# EAGLE schematic Main_backup (EAGLE 7.2.0)
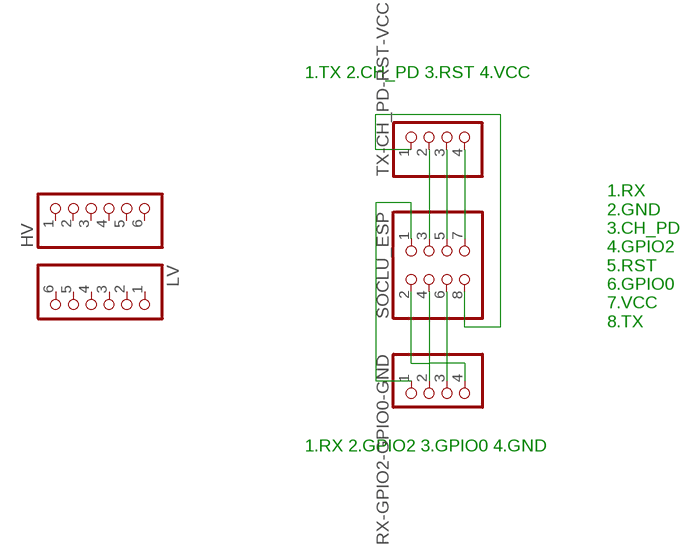
[diagram p0: schematic, sheet 1]

## Parts
HV  PINHD-1X6  [1X06]
LV  PINHD-1X6  [1X06]
RX-GPIO2-GPIO0-GND  PINHD-1X4  [1X04]
SOCLU_ESP  PINHD-2X4  [2X04]
TX-CH_PD-RST-VCC  PINHD-1X4  [1X04]

## Nets
N$1: SOCLU_ESP.7 TX-CH_PD-RST-VCC.4
N$2: SOCLU_ESP.5 TX-CH_PD-RST-VCC.3
N$3: SOCLU_ESP.3 TX-CH_PD-RST-VCC.2
N$4: SOCLU_ESP.8 TX-CH_PD-RST-VCC.1
N$5: RX-GPIO2-GPIO0-GND.1 SOCLU_ESP.1
N$7: RX-GPIO2-GPIO0-GND.4 SOCLU_ESP.2
N$8: RX-GPIO2-GPIO0-GND.3 SOCLU_ESP.6
N$9: RX-GPIO2-GPIO0-GND.2 SOCLU_ESP.4
Unconnected: HV.1 HV.2 HV.3 HV.4 HV.5 HV.6 LV.1 LV.2 LV.3 LV.4 LV.5 LV.6

## Notes on the sheet
- 1.TX 2.CH_PD 3.RST 4.VCC
- 1.RX
  2.GND
  3.CH_PD
  4.GPIO2
  5.RST
  6.GPIO0
  7.VCC
  8.TX
- 1.RX 2.GPIO2 3.GPIO0 4.GND

## Library data of the parts
HV LV = pinhead:PINHD-1X6: PIN HEADER
RX-GPIO2-GPIO0-GND TX-CH_PD-RST-VCC = pinhead:PINHD-1X4: PIN HEADER
SOCLU_ESP = pinhead:PINHD-2X4: PIN HEADER

## Net classes
0 default: width 0.032 mm, drill 0.032 mm